# EAGLE design PicKit2Clone (EAGLE 7.4.0)
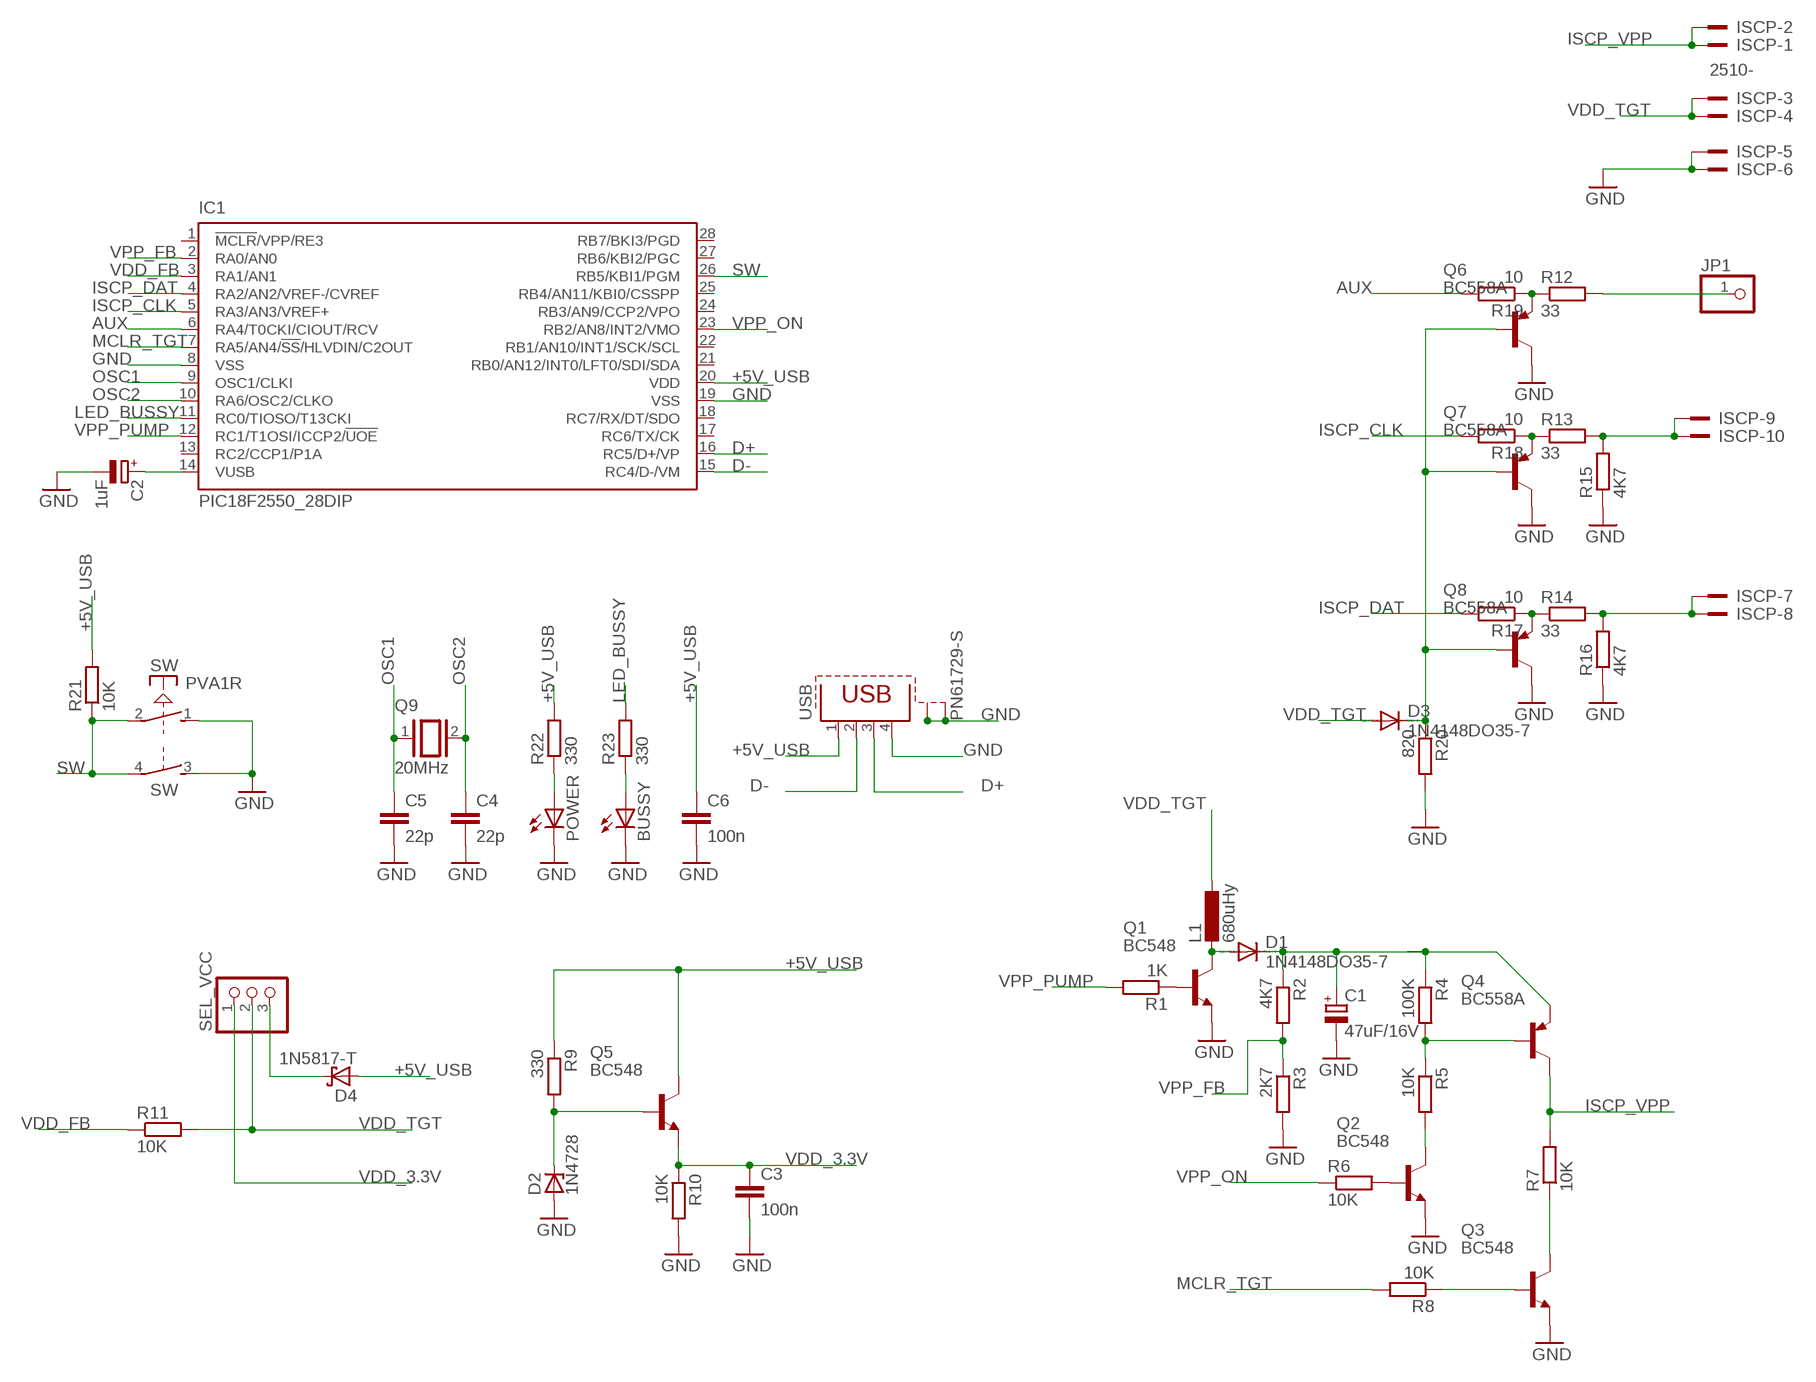
[diagram p0: schematic, sheet 1]

## Parts
BUSSY  LED5MM  [LED5MM]
C1  47uF/16V  CPOL-EUE1.8-4  [E1,8-4]
C2  1uF  CPOL-EUE1.8-4  [E1,8-4]
C3  100n  C-EU025-025X050  [C025-025X050]
C4  22p  C-EU025-024X044  [C025-024X044]
C5  22p  C-EU025-024X044  [C025-024X044]
C6  100n  C-EU025-024X044  [C025-024X044]
D1  1N4148DO35-7  [DO35-7]
D2  1N4728  [DO41Z10]
D3  1N4148DO35-7  [DO35-7]
D4  1N5817-T  [DO41-7.6]
IC1  PIC18F2550_28DIP  [DIL28-3]
ISCP  2510-  [PAK100/2500-10]
JP1  PINHD-1X1  [1X01]
L1  680uHy  L-EU0204/5  [0204/5]
POWER  LED5MM  [LED5MM]
Q1  BC548  [TO92-EBC]
Q2  BC548  [TO92-EBC]
Q3  BC548  [TO92-EBC]
Q4  BC558A  [TO92-EBC]
Q5  BC548  [TO92-EBC]
Q6  BC558A  [TO92-EBC]
Q7  BC558A  [TO92-EBC]
Q8  BC558A  [TO92-EBC]
Q9  20MHz  XTAL/S  [QS]
R1  1K  R-EU_0207/10  [0207/10]
R2  4K7  R-EU_0204/5  [0204/5]
R3  2K7  R-EU_0204/5  [0204/5]
R4  100K  R-EU_0204/5  [0204/5]
R5  10K  R-EU_0204/5  [0204/5]
R6  10K  R-EU_0204/7  [0204/7]
R7  10K  R-EU_0204/5  [0204/5]
R8  10K  R-EU_0204/5  [0204/5]
R9  330  R-EU_0204/5  [0204/5]
R10  10K  R-EU_0204/5  [0204/5]
R11  10K  R-EU_0204/5  [0204/5]
R12  33  R-EU_0204/5  [0204/5]
R13  33  R-EU_0204/5  [0204/5]
R14  33  R-EU_0204/5  [0204/5]
R15  4K7  R-EU_0204/5  [0204/5]
R16  4K7  R-EU_0204/5  [0204/5]
R17  10  R-EU_0204/5  [0204/5]
R18  10  R-EU_0204/5  [0204/5]
R19  10  R-EU_0204/5  [0204/5]
R20  820  R-EU_0204/5  [0204/5]
R21  10K  R-EU_0204/5  [0204/5]
R22  330  R-EU_0204/5  [0204/5]
R23  330  R-EU_0204/5  [0204/5]
SEL_VCC  PINHD-1X3  [1X03]
SW  PVA1R  [PVA1R]
USB  PN61729-S  [PN61729-S]

## Nets
+5V_USB: C6.1 D4.A IC1.20(VDD) Q5.C R9.1 R21.2 R22.2 USB.1
AUX: IC1.6(RA4/T0CKI/CIOUT/RCV) R19.2
D+: IC1.16(RC5/D+/VP) USB.3
D-: IC1.15(RC4/D-/VM) USB.2
GND: BUSSY.K(C) C1.- C2.- C3.2 C4.2 C5.2 C6.2 D2.A IC1.8(VSS) IC1.19(VSS) ISCP.5 ISCP.6 POWER.K(C) Q1.E Q2.E Q3.E Q6.C Q7.C Q8.C R3.2 R10.2 R15.1 R16.1 R20.2 SW.1(1:S) SW.3(2:S) USB.4 USB.S1 USB.S2
ISCP_CLK: IC1.5(RA3/AN3/VREF+) R18.2
ISCP_DAT: IC1.4(RA2/AN2/VREF-/CVREF) R17.2
ISCP_VPP: ISCP.1 ISCP.2 Q4.C R7.2
LED_BUSSY: IC1.11(RC0/TIOSO/T13CKI) R23.2
MCLR_TGT: IC1.7(RA5/AN4/!SS!/HLVDIN/C2OUT) R8.2
N$1: D1.A L1.2 Q1.C
N$2: Q1.B R1.1
N$3: C1.+ D1.C Q4.E R2.1 R4.1
N$4: Q4.B R4.2 R5.1
N$5: D2.C Q5.B R9.2
N$6: Q2.C R5.2
N$7: Q2.B R6.2
N$8: Q3.B R8.1
N$9: Q3.C R7.1
N$10: C2.+ IC1.14(VUSB)
N$11: D4.C SEL_VCC.3
N$12: Q6.E R12.1 R19.1
N$13: Q7.E R13.1 R18.1
N$14: Q8.E R14.1 R17.1
N$15: ISCP.9 ISCP.10 R13.2 R15.2
N$16: ISCP.7 ISCP.8 R14.2 R16.2
N$20: D3.C Q6.B Q7.B Q8.B R20.1
N$21: JP1.1 R12.2
N$22: BUSSY.A R23.1
N$23: POWER.A R22.1
OSC1: C5.1 IC1.9(OSC1/CLKI) Q9.1
OSC2: C4.1 IC1.10(RA6/OSC2/CLKO) Q9.2
SW: IC1.26(RB5/KBI1/PGM) R21.1 SW.2(1:P) SW.4(2:P)
VDD_3.3V: C3.1 Q5.E R10.1 SEL_VCC.1
VDD_FB: IC1.3(RA1/AN1) R11.1
VDD_TGT: D3.A ISCP.3 ISCP.4 L1.1 R11.2 SEL_VCC.2
VPP_FB: IC1.2(RA0/AN0) R2.2 R3.1
VPP_ON: IC1.23(RB2/AN8/INT2/VMO) R6.1
VPP_PUMP: IC1.12(RC1/T1OSI/ICCP2/!UOE) R1.2
Unconnected: IC1.1(!MCLR!/VPP/RE3) IC1.13(RC2/CCP1/P1A) IC1.17(RC6/TX/CK) IC1.18(RC7/RX/DT/SDO) IC1.21(RB0/AN12/INT0/LFT0/SDI/SDA) IC1.22(RB1/AN10/INT1/SCK/SCL) IC1.24(RB3/AN9/CCP2/VPO) IC1.25(RB4/AN11/KBI0/CSSPP) IC1.27(RB6/KBI2/PGC) IC1.28(RB7/BKI3/PGD)

## Library data of the parts
BUSSY POWER = led:LED: LED OSRAM: - CHIPLED LG R971, LG N971, LY N971, LG Q971, LY Q971, LO R971, LY R971 LH N974, LH R974 LS Q976, LO Q976, LY Q976 LO Q996 - Hyper CHIPLED LW Q18S LB Q993, LB Q99A, LB R99A - SideLED LS A670, LO A670, LY A670, LG A670, LP A670 LB A673, LV A673, LT A673, LW A673 LH A674 LY A675 LS A676, LA A676, LO A676, LY A676, LW A676 LS A679, LY A679, LG A679 - Hyper Micro SIDELED® LS Y876, LA Y876, LO Y876, LY Y876 LT Y87S - SmartLED LW L88C, LW L88S LB L89C, LB L89S, LG L890 LS L89K, LO L89K, LY L89K LS L896, LA L896, LO L896, LY L896 - TOPLED LS T670, LO T670, LY T670, LG T670, LP T670 LSG T670, LSP T670, LSY T670, LOP T670, LYG T670 LG T671, LOG T671, LSG T671 LB T673, LV T673, LT T673, LW T673 LH T674 LS T676, LA T676, LO T676, LY T676, LB T676, LH T676, LSB T676, LW T676 LB T67C, LV T67C, LT T67C, LS T67K, LO T67K, LY T67K, LW E67C LS E67B, LA E67B, LO E67B, LY E67B, LB E67C, LV E67C, LT E67C LW T67C LS T679, LY T679, LG T679 LS T770, LO T770, LY T770, LG T770, LP T770 LB T773, LV T773, LT T773, LW T773 LH T774 LS E675, LA E675, LY E675, LS T675 LS T776, LA T776, LO T776, LY T776, LB T776 LHGB T686 LT T68C, LB T68C - Hyper Mini TOPLED® LB M676 - Mini TOPLED Santana® LG M470 LS M47K, LO M47K, LY M47K Source: http://www.osram.convergy.de LUXEON: - LUMILED® LXK2-PW12-R00, LXK2-PW12-S00, LXK2-PW14-U00, LXK2-PW14-V00 LXK2-PM12-R00, LXK2-PM12-S00, LXK2-PM14-U00 LXK2-PE12-Q00, LXK2-PE12-R00, LXK2-PE12-S00, LXK2-PE14-T00, LXK2-PE14-U00 LXK2-PB12-K00, LXK2-PB12-L00, LXK2-PB12-M00, LXK2-PB14-N00, LXK2-PB14-P00, LXK2-PB14-Q00 LXK2-PR12-L00, LXK2-PR12-M00, LXK2-PR14-Q00, LXK2-PR14-R00 LXK2-PD12-Q00, LXK2-PD12-R00, LXK2-PD12-S00 LXK2-PH12-R00, LXK2-PH12-S00 LXK2-PL12-P00, LXK2-PL12-Q00, LXK2-PL12-R00 Source: www.luxeon.com KINGBRIGHT: KA-3528ASYC Source: www.kingbright.com
C1 C2 = rcl:CPOL-EU: POLARIZED CAPACITOR, European symbol
C3-C6 = rcl:C-EU: CAPACITOR, European symbol
D1 D3 = diode:1N4148: DIODE high speed (Philips)
D2 = diode:1N4728: Z DIODE 3.3 V, 1W, 5 percent
D4 = diode:1N581*: 1.0A SCHOTTKY BARRIER RECTIFIER Source: http://www.diodes.com/datasheets/ds23001.pdf
IC1 = microchip:PIC18F2*_28: USB Microcontrollers with nanoWatt Technology High-Performance, Enhanced Flash, 28/40/44-Pin, Source: http://ww1.microchip.com/downloads/en/devicedoc/39632c.pdf; MF: MICROCHIP; MPN: PIC18F2550-I/SP; OC_FARNELL: 1523822; OC_NEWARK: 80K6054
ISCP = con-3m:2510-: 3M (TM) Pak 100 4-Wall Header Source: 3M; MF: 3M; MPN: 2510-6002UB; OC_FARNELL: 9838244; OC_NEWARK: 46F4725
JP1 = pinhead:PINHD-1X1: PIN HEADER
L1 = rcl:L-EU: INDUCTOR, European symbol
Q1-Q3 Q5 = transistor-npn:BC548*: NPN Transistor
Q4 Q6-Q8 = transistor-pnp:BC558*: PNP Transistror
Q9 = special:XTAL/S: CRYSTAL
R1-R23 = resistor:R-EU_: RESISTOR, European symbol
SEL_VCC = pinhead:PINHD-1X3: PIN HEADER
SW = switch-misc:PVA1R: ITT SWITCH
USB = con-berg:PN61729-S: BERG USB connector; OC_FARNELL: unknown; OC_NEWARK: unknown

## Board
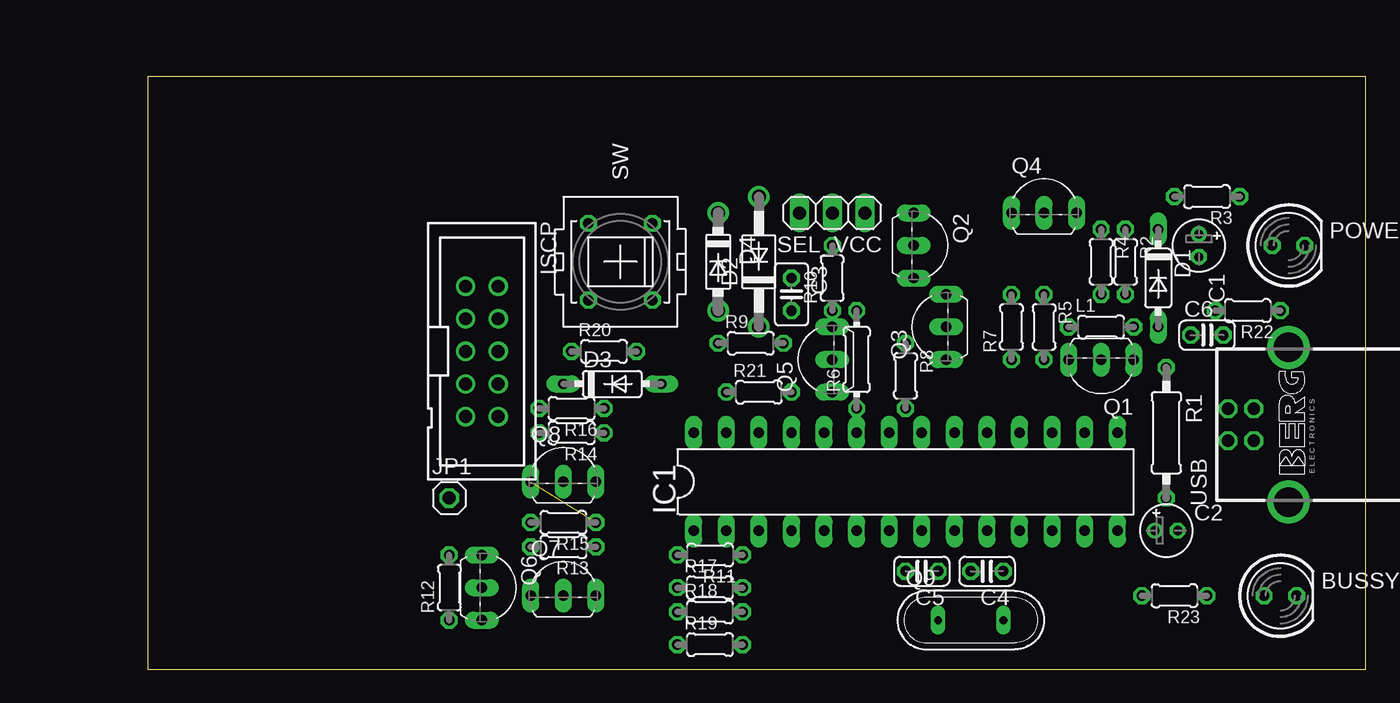
[diagram p1: board, top side]
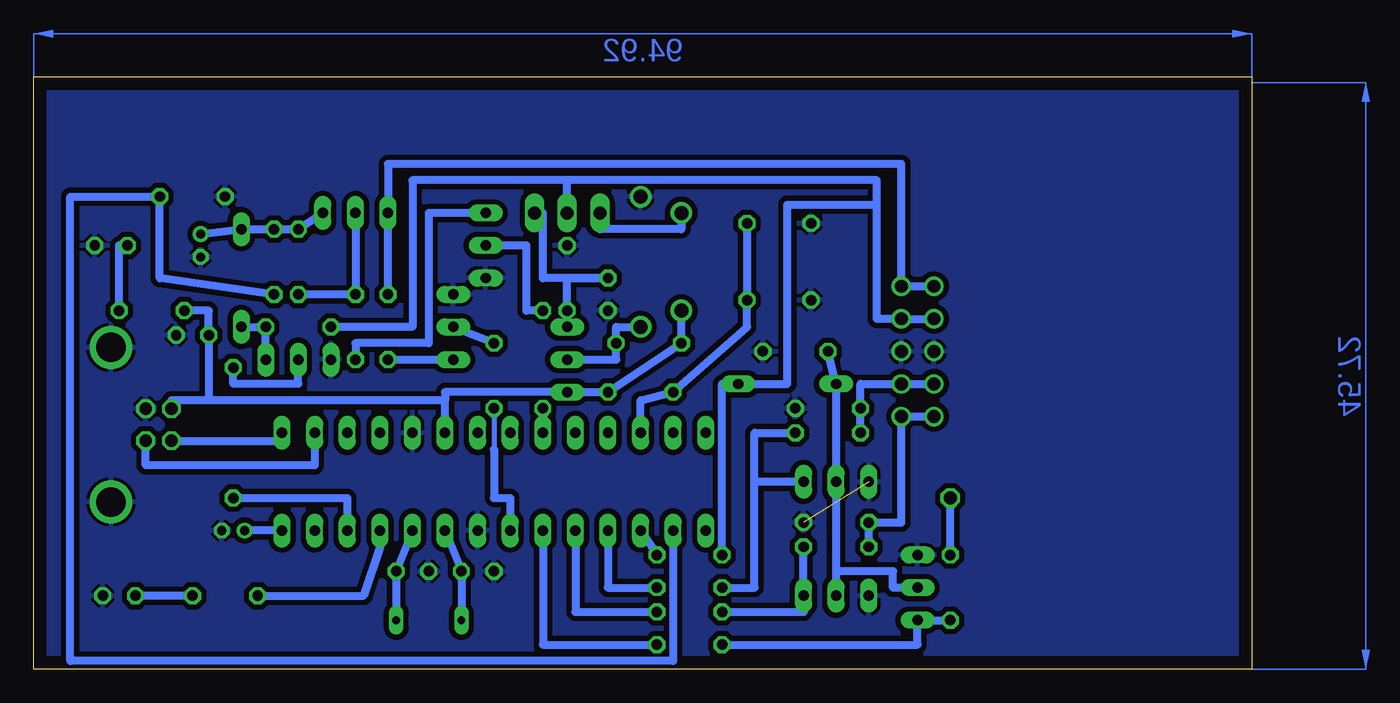
[diagram p2: board, bottom side, seen from below]

Size 94.92 x 46.19 mm. Coordinates in mm from the lower left corner, seen from the top.
Outline: 0,0 94.92,0 94.92,46.19 0,46.19 0,0
Copper layers (1*16): Top 0.035mm / dielectric 1.5mm / Bottom 0.035mm
Design rules "default *": minimum track width 10mil, minimum drill 24mil, track to track 16mil, track to pad 16mil, pad to pad 16mil, via to via 16mil, smd to smd 8mil, copper to edge 40mil, drill to drill 8mil, minimum pad ring 10mil, minimum via ring 8mil, stop-mask expansion 4mil, vias tented up to drill 0mil, thermal gap 10mil

### Footprints (pad centres in the part's own frame; a part is rotated, then mirrored left to right if it is on the bottom)
LED5MM = drill 0.813 octagon: A -1.27,0; K 1.27,0
E1,8-4 = drill 0.711 pad 1.168: + -0.889,0 | drill 0.711 pad 1.168 octagon: - 0.889,0
C025-025X050 = drill 0.813 octagon: 1 -1.27,0; 2 1.27,0
C025-024X044 = drill 0.813 octagon: 1 -1.27,0; 2 1.27,0
DO35-7 = drill 0.813 long: A 3.81,0; C -3.81,0
DO41Z10 = drill 1.118: A 5.08,0; C -5.08,0
DO41-7.6 = drill 1.1 pad 1.7: A 3.81,0; C -3.81,0
DIL28-3 = drill 0.813 long: 1 -16.51,-3.81; 2 -13.97,-3.81; 3 -11.43,-3.81; 4 -8.89,-3.81; 5 -6.35,-3.81; 6 -3.81,-3.81; 7 -1.27,-3.81; 8 1.27,-3.81; 9 3.81,-3.81; 10 6.35,-3.81; 11 8.89,-3.81; 12 11.43,-3.81; 13 13.97,-3.81; 14 16.51,-3.81; 15 16.51,3.81; 16 13.97,3.81; 17 11.43,3.81; 18 8.89,3.81; 19 6.35,3.81; 20 3.81,3.81; 21 1.27,3.81; 22 -1.27,3.81; 23 -3.81,3.81; 24 -6.35,3.81; 25 -8.89,3.81; 26 -11.43,3.81; 27 -13.97,3.81; 28 -16.51,3.81
PAK100/2500-10 = drill 1 pad 1.422: 1 -5.08,-1.27; 2 -5.08,1.27; 3 -2.54,-1.27; 4 -2.54,1.27; 5 0,-1.27; 6 0,1.27; 7 2.54,-1.27; 8 2.54,1.27; 9 5.08,-1.27; 10 5.08,1.27
1X01 = drill 1.016 octagon: 1 0,0
0204/5 = drill 0.813 octagon: 1 -2.54,0; 2 2.54,0
TO92-EBC = drill 0.813 long: B 0,-1.27; C -2.54,-1.27; E 2.54,-1.27
QS = drill 0.61 long: 1 -2.54,0; 2 2.54,0
0207/10 = drill 0.813 octagon: 1 -5.08,0; 2 5.08,0
0204/7 = drill 0.813 octagon: 1 -3.81,0; 2 3.81,0
1X03 = drill 1.016 long: 1 -2.54,0; 2 0,0; 3 2.54,0
PVA1R = drill 0.813 octagon: 1 -2.997,2.489; 2 -2.997,-2.489; 3 2.997,2.489; 4 2.997,-2.489
PN61729-S = drill 0.95 octagon: 1 1.25,4.71; 2 -1.25,4.71; 3 -1.25,2.71; 4 1.25,2.71 | drill 2.3 pad 2.9: S1 -6.02,0; S2 6.02,0

### Placement (x,y rotation side)
BUSSY  88.27,5.71 0 top
C1  81.92,33.02 270 top
C2  79.38,10.79 0 top
C3  50.16,29.21 270 top
C4  65.41,7.62 180 top
C5  60.33,7.62 180 top
C6  82.55,26.04 0 top
D1  78.74,30.48 270 top
D2  47.62,31.75 90 top
D3  36.2,22.23 0 top
D4  44.45,31.75 270 top
IC1  59.06,14.6 0 top
ISCP  26.03,24.77 270 top
JP1  23.49,13.33 0 top
L1  74.3,26.67 0 top
POWER  88.9,33.02 0 top
Q1  74.3,22.86 180 top
Q2  60.96,33.02 270 top
Q3  60.96,26.67 90 top
Q4  69.85,36.83 0 top
Q5  52.07,24.13 90 top
Q6  27.3,6.35 270 top
Q7  32.39,6.98 0 top
Q8  32.39,15.87 0 top
Q9  64.14,3.81 0 top
R1  79.38,18.42 270 top
R2  76.2,31.75 270 top
R3  82.55,36.83 180 top
R4  74.3,31.75 270 top
R5  69.85,26.67 270 top
R6  55.25,24.13 90 top
R7  67.31,26.67 90 top
R8  59.06,22.86 270 top
R9  46.99,25.4 0 top
R10  53.34,30.48 90 top
R11  43.82,8.89 180 top
R12  23.49,6.35 90 top
R13  32.39,9.53 180 top
R14  33.02,18.42 180 top
R15  32.39,11.43 180 top
R16  33.02,20.32 180 top
R17  43.82,6.35 0 top
R18  43.82,4.45 0 top
R19  43.82,1.9 0 top
R20  35.56,24.77 0 top
R21  47.62,21.59 0 top
R22  85.73,27.94 180 top
R23  80.01,5.71 180 top
SEL_VCC  53.34,35.56 180 top
SW  36.83,31.75 90 top
USB  88.9,19.05 90 top

### Tracks (layer width: path | path; a pad name or v marks a point on that pad's centre or on a via)
+5V_USB
  Bottom 0.61: IC1.20 62.86,20.96 | USB.1 84.19,20.96 81.28,20.96 | 62.86,20.96 81.28,20.96 | 62.86,20.96 62.86,21.59 Q5.C R21.2 R9.1 D4.A | 81.28,20.96 C6.1 81.28,27.94 R22.2
AUX
  Bottom 0.61: IC1.6 55.25,1.9 R19.2
D+
  Bottom 0.61: IC1.16 73.03,15.87 86.19,15.87 USB.3
D-
  Bottom 0.61: USB.2 75.56,17.8 IC1.15
GND  (1 unrouted)
  pour Bottom: 0,45.72 95.25,45.72 95.25,0 0,0
ISCP_CLK
  Bottom 0.61: IC1.5 52.7,4.45 R18.2
ISCP_DAT
  Bottom 0.61: IC1.4 50.16,6.35 R17.2
ISCP_VPP
  Bottom 0.61: R7.2 Q4.C 67.31,39.37 27.3,39.37 ISCP.2 ISCP.1
LED_BUSSY
  Bottom 0.61: IC1.11 67.95,9.53 69.22,5.71 R23.2
MCLR_TGT
  Bottom 0.406: R8.2 59.06,17.14
  Bottom 0.61: 59.06,17.14 59.06,13.33 57.79,13.33 IC1.7
N$1
  Bottom 0.61: Q1.C L1.2 D1.A
N$2
  Bottom 0.61: Q1.B 74.3,22.23 79.38,22.23 R1.1
N$3
  Bottom 0.61: C1.+ D1.C R2.1 R4.1 Q4.E
N$4
  Bottom 0.61: R4.2 R5.1 Q4.B
N$5
  Bottom 0.61: D2.C 49.53,26.67 R9.2 49.53,24.13 Q5.B
N$6
  Bottom 0.61: Q2.C 64.14,35.56 64.14,25.4 69.85,25.4 R5.2
N$7
  Bottom 0.61: R6.2 56.52,27.94 56.52,33.02 Q2.B
N$8
  Bottom 0.61: R8.1 Q3.B
N$9
  Bottom 0.61: R7.1 Q3.C
N$10
  Bottom 0.61: IC1.14 C2.+
N$11
  Bottom 0.61: D4.C 44.45,34.29 50.8,34.29 SEL_VCC.3
N$12
  Bottom 0.61: R19.1 26.03,1.9 Q6.E R12.1
N$13
  Bottom 0.61: R13.1 Q7.E 34.93,4.45 R18.1
N$14
  Bottom 0.61: R17.1 38.73,6.35 38.73,14.6 | 38.73,14.6 38.73,18.42 R14.1 | Q8.E 38.73,14.6
N$15
  Bottom 0.61: R13.2 R15.2 27.3,11.43 ISCP.10 ISCP.9
N$16
  Bottom 0.61: R14.2 R16.2 30.48,22.23 ISCP.8 ISCP.7
N$20
  Bottom 0.61: R20.1 D3.C Q8.B 32.39,7.62 | 32.39,7.62 Q7.B | Q6.B 27.94,6.35 27.94,7.62 32.39,7.62
N$21
  Bottom 0.61: R12.2 JP1.1
N$22
  Bottom 0.61: R23.1 BUSSY.A
N$23
  Bottom 0.61: R22.1 88.27,33.02 POWER.A
OSC1
  Bottom 0.61: IC1.9 C5.1 Q9.1
OSC2
  Bottom 0.61: IC1.10 C4.1 Q9.2
SW
  Bottom 0.61: IC1.26 47.62,20.96 R21.1 39.32,26.67 SW.2 SW.4
VDD_3.3V
  Bottom 0.61: Q5.E R10.1 53.34,30.48 C3.1 55.25,30.48 55.25,35.56 SEL_VCC.1
VDD_FB
  Bottom 0.61: IC1.3 R11.1
VDD_TGT
  Bottom 0.61: R11.2 41.27,22.23 D3.A 36.2,22.23 36.2,36.2 29.21,36.2 | ISCP.3 ISCP.4 29.21,27.3 29.21,36.2 | 29.21,36.2 29.21,38.1 53.34,38.1 | 53.34,38.1 65.41,38.1 65.41,26.67 L1.1 | SEL_VCC.2 53.34,38.1
VPP_FB
  Bottom 0.61: R2.2 85.09,30.48 R3.1 92.08,36.83 92.08,0.64 45.09,0.64 IC1.2
VPP_ON
  Bottom 0.61: R6.1 IC1.23
VPP_PUMP
  Bottom 0.61: R1.2 70.48,13.33 IC1.12
(copper drawn outside any net)
  shapes: Bottom area x2